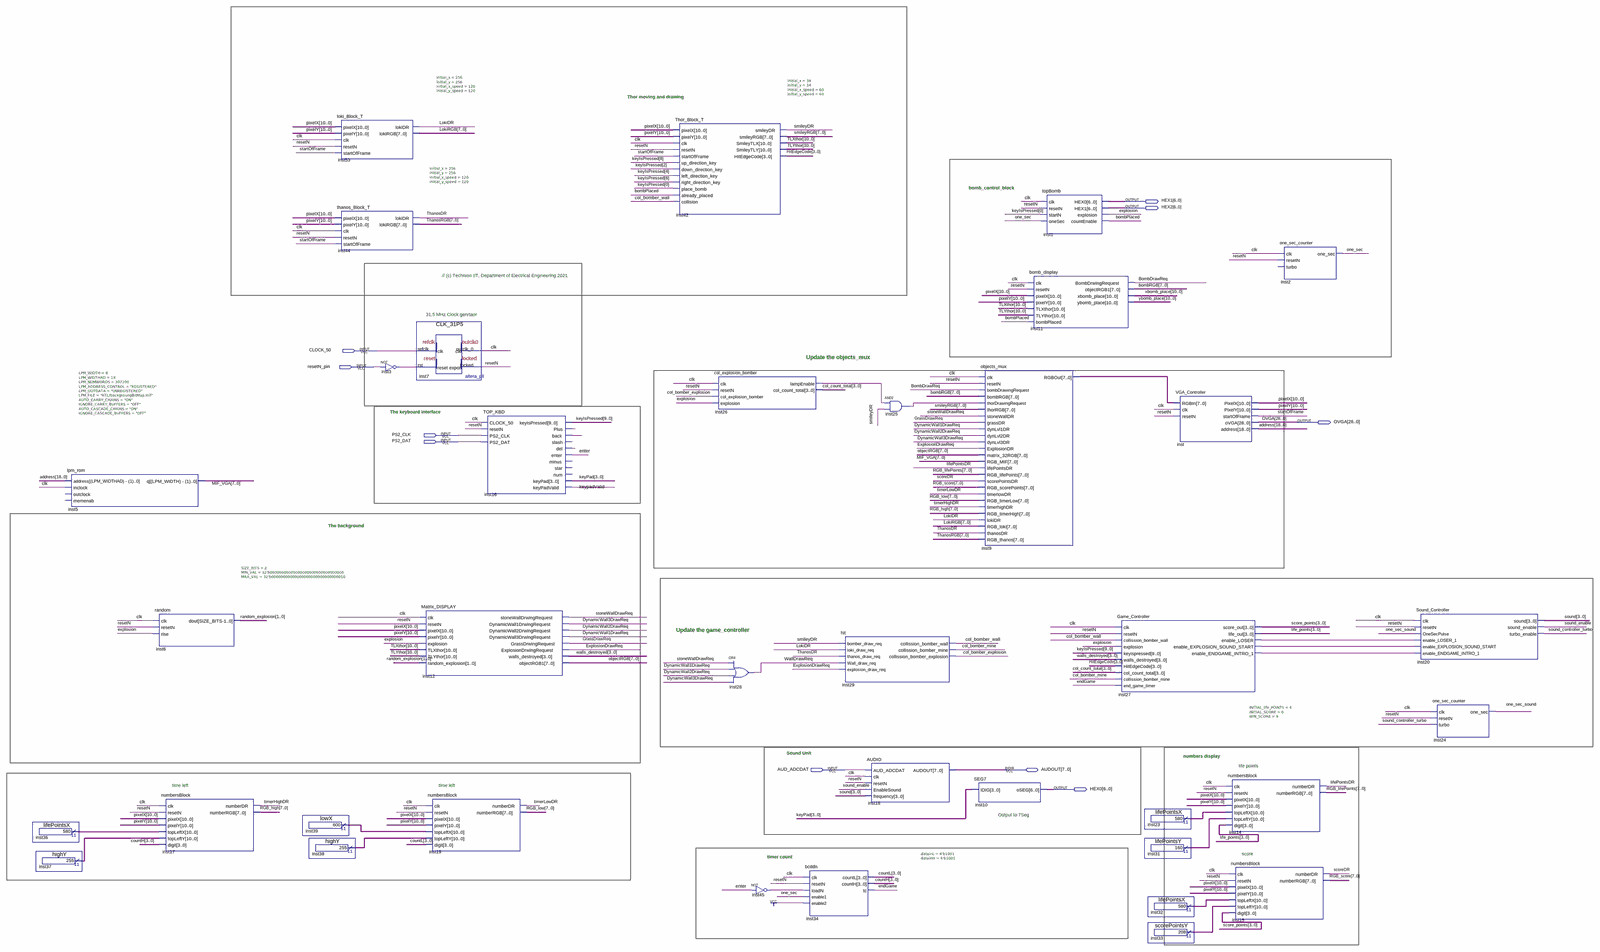
[diagram p0: schematic sheet, whole]
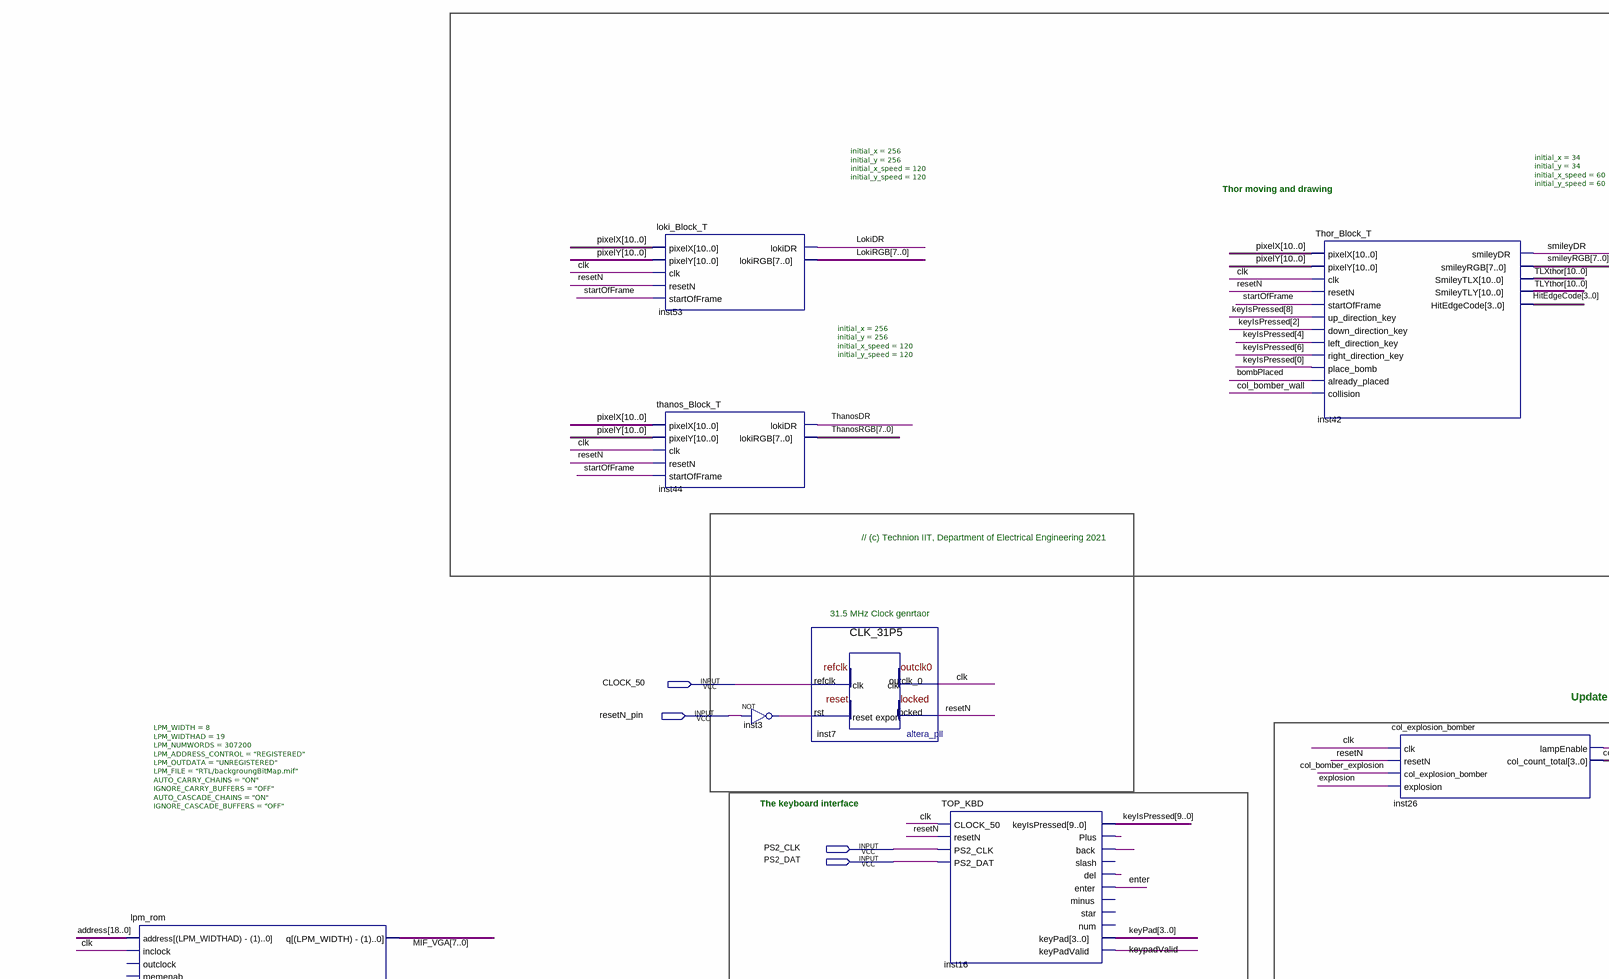
[diagram p1: schematic sheet, upper left part]
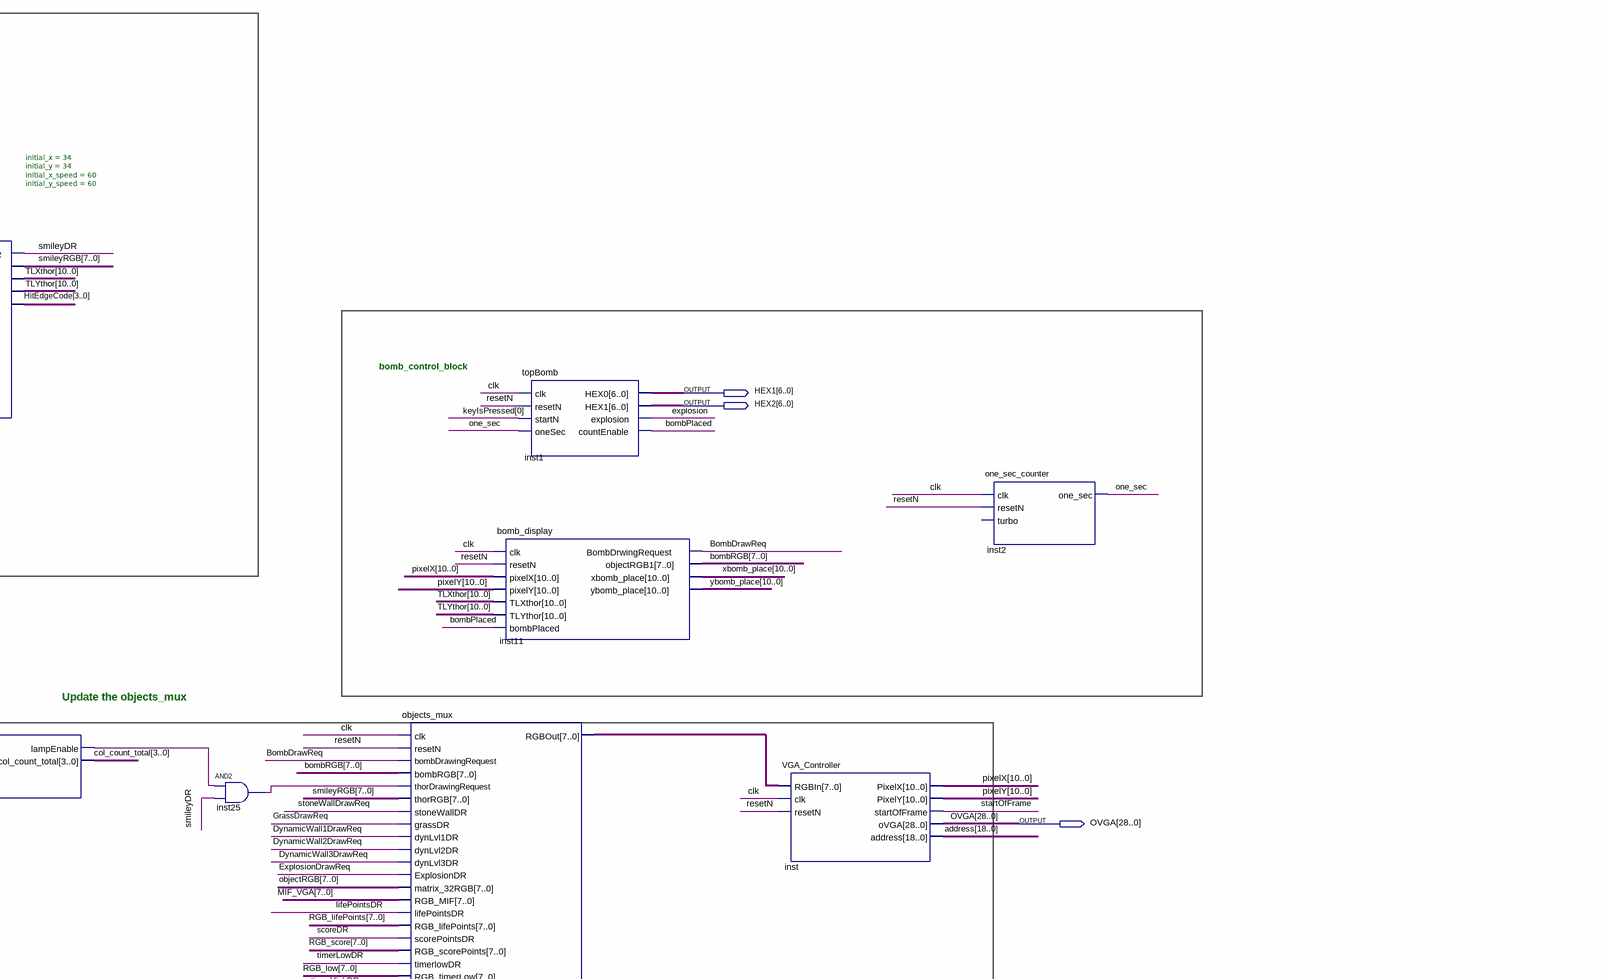
[diagram p2: schematic sheet, upper right part]
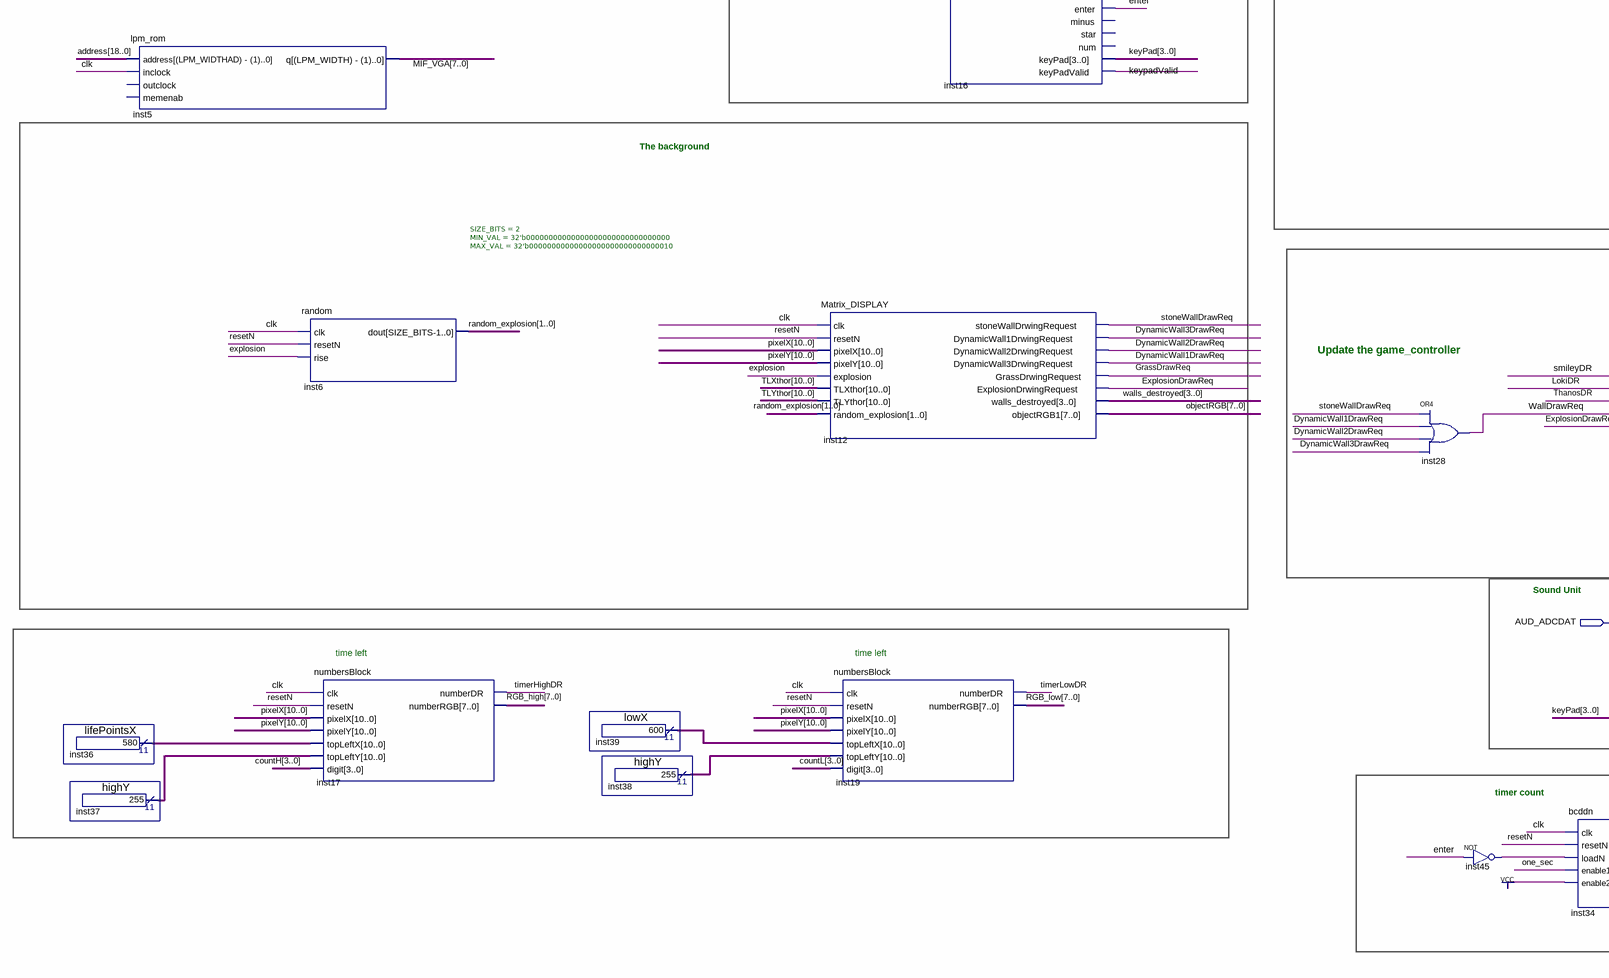
[diagram p3: schematic sheet, lower left part]
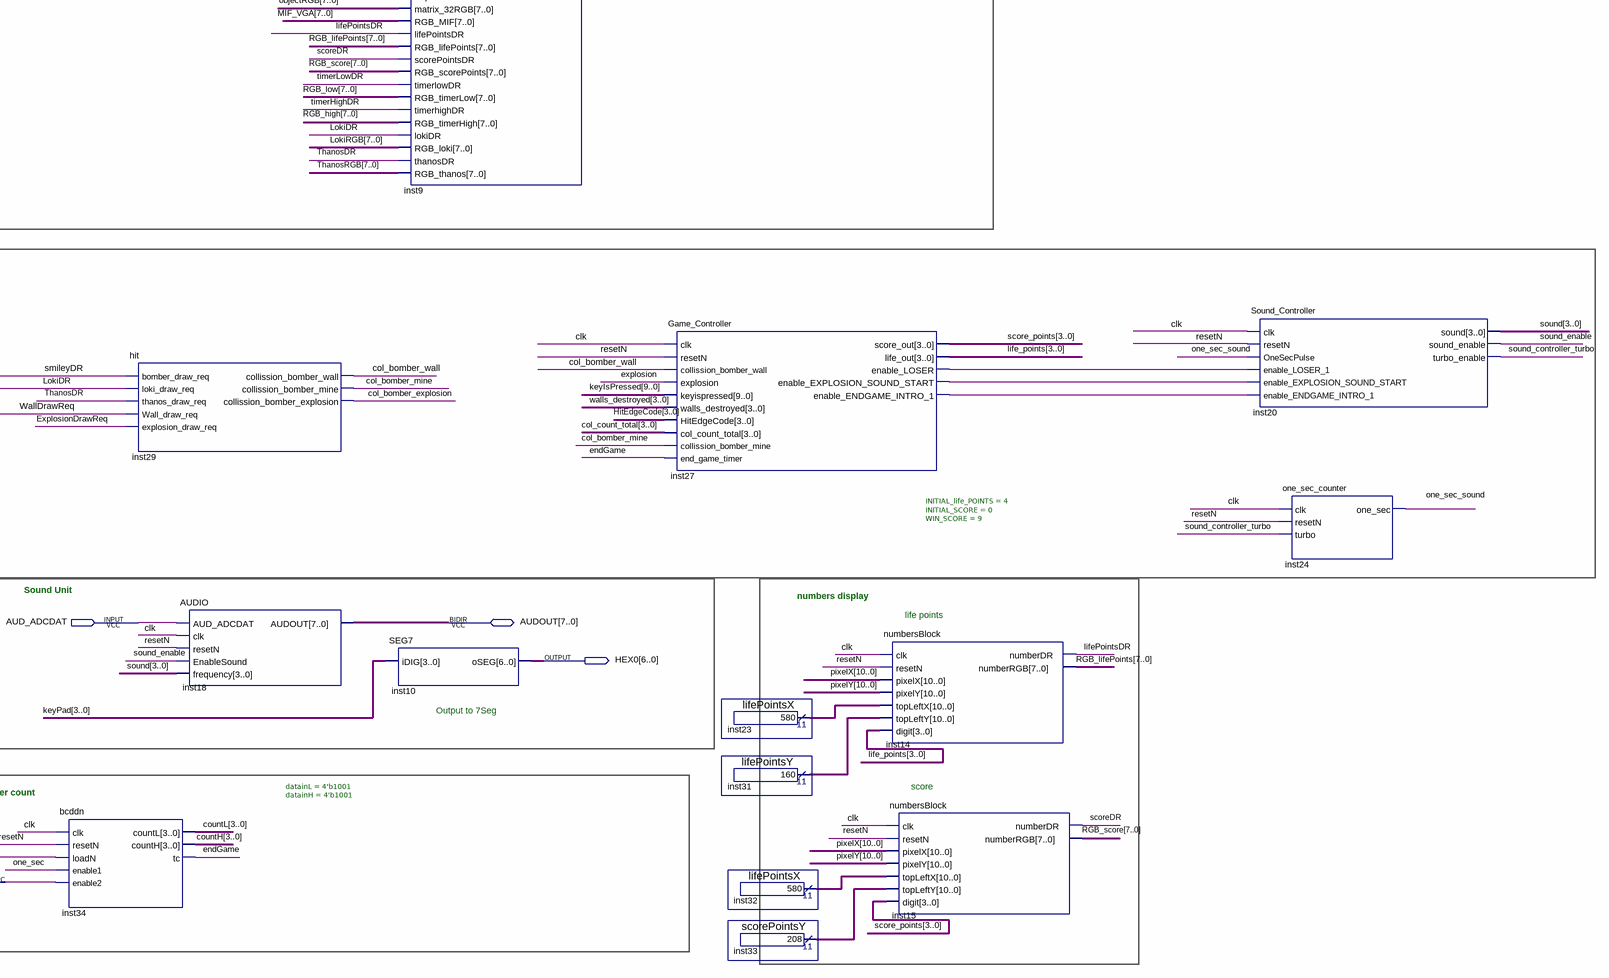
[diagram p4: schematic sheet, lower right part]
// Quartus schematic TOP_VGA_DEMO_KBD.bdf as structural Verilog: 37 symbols, 10 pins
module TOP_VGA_DEMO_KBD (
  input  CLOCK_50,
  input  resetN_pin,
  input  PS2_CLK,
  input  PS2_DAT,
  input  AUD_ADCDAT,
  inout  [7:0] AUDOUT,
  output [6:0] HEX1,
  output [6:0] HEX2,
  output [28:0] OVGA,
  output [6:0] HEX0
);

  wire BombDrawReq, bombPlaced, clk, col_bomber_explosion, col_bomber_mine, col_bomber_wall,
       DynamicWall1DrawReq, DynamicWall2DrawReq, DynamicWall3DrawReq, endGame, enter, explosion,
       ExplosionDrawReq, GrassDrawReq, inst3_out, inst16_back, inst16_del, inst16_plus, inst25_out,
       inst26_lampenable, inst27_enable_endgame_intro_1, inst27_enable_explosion_sound_start,
       inst27_enable_loser, inst45_out, keypadValid, lifePointsDR, LokiDR, one_sec, one_sec_sound, resetN,
       scoreDR, smileyDR, sound_controller_turbo, sound_enable, startOfFrame, stoneWallDrawReq, ThanosDR,
       timerHighDR, timerLowDR, WallDrawReq;
  wire [1:0] random_explosion;
  wire [3:0] col_count_total, countH, countL, HitEdgeCode, keyPad, life_points, score_points, sound,
       walls_destroyed;
  wire [7:0] bombRGB, inst9_rgbout, LokiRGB, MIF_VGA, objectRGB, RGB_high, RGB_lifePoints, RGB_low,
       RGB_score, smileyRGB, ThanosRGB;
  wire [9:0] keyIsPressed;
  wire [10:0] inst23_result, inst31_result, inst32_result, inst33_result, inst36_result, inst37_result,
       inst38_result, inst39_result, pixelX, pixelY, TLXthor, TLYthor, xbomb_place, ybomb_place;
  wire [18:0] address;

  lifePointsX inst36 (.result(inst36_result));
  highY inst37 (.result(inst37_result));
  lpm_rom #(.LPM_WIDTH(8), .LPM_WIDTHAD(19), .LPM_NUMWORDS(307200), .LPM_ADDRESS_CONTROL("REGISTERED"), .LPM_OUTDATA("UNREGISTERED"), .LPM_FILE("RTL/backgroungBitMap.mif"), .AUTO_CARRY_CHAINS("ON"), .IGNORE_CARRY_BUFFERS("OFF"), .AUTO_CASCADE_CHAINS("ON"), .IGNORE_CASCADE_BUFFERS("OFF")) inst5 (
    .address(address), .inclock(clk), .q(MIF_VGA));  // open: outclock, memenab
  random #(.SIZE_BITS(2), .MIN_VAL(32'b00000000000000000000000000000000), .MAX_VAL(32'b00000000000000000000000000000010)) inst6 (
    .clk(clk), .resetN(resetN), .rise(explosion), .dout(random_explosion));
  numbersBlock inst17 (
    .clk(clk), .resetN(resetN), .pixelX(pixelX), .pixelY(pixelY), .topLeftX(inst36_result),
    .topLeftY(inst37_result), .digit(countH), .numberDR(timerHighDR), .numberRGB(RGB_high));
  lowX inst39 (.result(inst39_result));
  highY inst38 (.result(inst38_result));
  loki_Block_T #(.initial_x(256), .initial_y(256), .initial_x_speed(120), .initial_y_speed(120)) inst53 (
    .pixelX(pixelX), .pixelY(pixelY), .clk(clk), .resetN(resetN), .startOfFrame(startOfFrame),
    .lokiDR(LokiDR), .lokiRGB(LokiRGB));
  thanos_Block_T #(.initial_x(256), .initial_y(256), .initial_x_speed(120), .initial_y_speed(120)) inst44 (
    .pixelX(pixelX), .pixelY(pixelY), .clk(clk), .resetN(resetN), .startOfFrame(startOfFrame),
    .lokiDR(ThanosDR), .lokiRGB(ThanosRGB));
  not inst3 (inst3_out, resetN_pin);
  CLK_31P5 inst7 (.refclk(CLOCK_50), .rst(inst3_out), .outclk_0(clk), .locked(resetN));
  Matrix_DISPLAY inst12 (
    .clk(clk), .resetN(resetN), .pixelX(pixelX), .pixelY(pixelY), .explosion(explosion), .TLXthor(TLXthor),
    .TLYthor(TLYthor), .random_explosion(random_explosion), .stoneWallDrwingRequest(stoneWallDrawReq),
    .DynamicWall1DrwingRequest(DynamicWall3DrawReq), .DynamicWall2DrwingRequest(DynamicWall2DrawReq),
    .DynamicWall3DrwingRequest(DynamicWall1DrawReq), .GrassDrwingRequest(GrassDrawReq),
    .ExplosionDrwingRequest(ExplosionDrawReq), .walls_destroyed(walls_destroyed), .objectRGB1(objectRGB));
  numbersBlock inst19 (
    .clk(clk), .resetN(resetN), .pixelX(pixelX), .pixelY(pixelY), .topLeftX(inst39_result),
    .topLeftY(inst38_result), .digit(countL), .numberDR(timerLowDR), .numberRGB(RGB_low));
  TOP_KBD inst16 (
    .CLOCK_50(clk), .resetN(resetN), .PS2_CLK(PS2_CLK), .PS2_DAT(PS2_DAT), .keyIsPressed(keyIsPressed),
    .Plus(inst16_plus), .back(inst16_back), .del(inst16_del), .enter(enter), .keyPad(keyPad),
    .keyPadValid(keypadValid));  // open: slash, minus, star, num
  Thor_Block_T #(.initial_x(34), .initial_y(34), .initial_x_speed(60), .initial_y_speed(60)) inst42 (
    .pixelX(pixelX), .pixelY(pixelY), .clk(clk), .resetN(resetN), .startOfFrame(startOfFrame),
    .up_direction_key(keyIsPressed[8]), .down_direction_key(keyIsPressed[2]),
    .left_direction_key(keyIsPressed[4]), .right_direction_key(keyIsPressed[6]),
    .place_bomb(keyIsPressed[0]), .already_placed(bombPlaced), .collision(col_bomber_wall),
    .smileyDR(smileyDR), .smileyRGB(smileyRGB), .SmileyTLX(TLXthor), .SmileyTLY(TLYthor),
    .HitEdgeCode(HitEdgeCode));
  col_explosion_bomber inst26 (
    .clk(clk), .resetN(resetN), .col_explosion_bomber(col_bomber_explosion), .explosion(explosion),
    .lampEnable(inst26_lampenable), .col_count_total(col_count_total));
  or inst28 (WallDrawReq, stoneWallDrawReq, DynamicWall1DrawReq, DynamicWall2DrawReq, DynamicWall3DrawReq);
  not inst45 (inst45_out, enter);
  bcddn #(.datainL(4'b1001), .datainH(4'b1001)) inst34 (
    .clk(clk), .resetN(resetN), .loadN(inst45_out), .enable1(one_sec), .enable2(1'b1), .countL(countL),
    .countH(countH), .tc(endGame));
  hit inst29 (
    .bomber_draw_req(smileyDR), .loki_draw_req(LokiDR), .thanos_draw_req(ThanosDR),
    .Wall_draw_req(WallDrawReq), .explosion_draw_req(ExplosionDrawReq),
    .collission_bomber_wall(col_bomber_wall), .collission_bomber_mine(col_bomber_mine),
    .collission_bomber_explosion(col_bomber_explosion));
  AUDIO inst18 (
    .AUD_ADCDAT(AUD_ADCDAT), .clk(clk), .resetN(resetN), .EnableSound(sound_enable), .frequency(sound),
    .AUDOUT(AUDOUT));
  and inst25 (inst25_out, inst26_lampenable, smileyDR);
  objects_mux inst9 (
    .clk(clk), .resetN(resetN), .bombDrawingRequest(BombDrawReq), .bombRGB(bombRGB),
    .thorDrawingRequest(inst25_out), .thorRGB(smileyRGB), .stoneWallDR(stoneWallDrawReq),
    .grassDR(GrassDrawReq), .dynLvl1DR(DynamicWall1DrawReq), .dynLvl2DR(DynamicWall2DrawReq),
    .dynLvl3DR(DynamicWall3DrawReq), .ExplosionDR(ExplosionDrawReq), .matrix_32RGB(objectRGB),
    .RGB_MIF(MIF_VGA), .lifePointsDR(lifePointsDR), .RGB_lifePoints(RGB_lifePoints), .scorePointsDR(scoreDR),
    .RGB_scorePoints(RGB_score), .timerlowDR(timerLowDR), .RGB_timerLow(RGB_low), .timerhighDR(timerHighDR),
    .RGB_timerHigh(RGB_high), .lokiDR(LokiDR), .RGB_loki(LokiRGB), .thanosDR(ThanosDR),
    .RGB_thanos(ThanosRGB), .RGBOut(inst9_rgbout));
  SEG7 inst10 (.iDIG(keyPad), .oSEG(HEX0));
  bomb_display inst11 (
    .clk(clk), .resetN(resetN), .pixelX(pixelX), .pixelY(pixelY), .TLXthor(TLXthor), .TLYthor(TLYthor),
    .bombPlaced(bombPlaced), .BombDrwingRequest(BombDrawReq), .objectRGB1(bombRGB),
    .xbomb_place(xbomb_place), .ybomb_place(ybomb_place));
  topBomb inst1 (
    .clk(clk), .resetN(resetN), .startN(keyIsPressed[0]), .oneSec(one_sec), .HEX0(HEX1), .HEX1(HEX2),
    .explosion(explosion), .countEnable(bombPlaced));
  Game_Controller #(.INITIAL_life_POINTS(4), .INITIAL_SCORE(0), .WIN_SCORE(9)) inst27 (
    .clk(clk), .resetN(resetN), .collission_bomber_wall(col_bomber_wall), .explosion(explosion),
    .keyispressed(keyIsPressed), .walls_destroyed(walls_destroyed), .HitEdgeCode(HitEdgeCode),
    .col_count_total(col_count_total), .collission_bomber_mine(col_bomber_mine), .end_game_timer(endGame),
    .score_out(score_points), .life_out(life_points), .enable_LOSER(inst27_enable_loser),
    .enable_EXPLOSION_SOUND_START(inst27_enable_explosion_sound_start),
    .enable_ENDGAME_INTRO_1(inst27_enable_endgame_intro_1));
  lifePointsX inst23 (.result(inst23_result));
  lifePointsY inst31 (.result(inst31_result));
  lifePointsX inst32 (.result(inst32_result));
  scorePointsY inst33 (.result(inst33_result));
  VGA_Controller inst (
    .RGBIn(inst9_rgbout), .clk(clk), .resetN(resetN), .PixelX(pixelX), .PixelY(pixelY),
    .startOfFrame(startOfFrame), .oVGA(OVGA), .address(address));
  numbersBlock inst14 (
    .clk(clk), .resetN(resetN), .pixelX(pixelX), .pixelY(pixelY), .topLeftX(inst23_result),
    .topLeftY(inst31_result), .digit(life_points), .numberDR(lifePointsDR), .numberRGB(RGB_lifePoints));
  numbersBlock inst15 (
    .clk(clk), .resetN(resetN), .pixelX(pixelX), .pixelY(pixelY), .topLeftX(inst32_result),
    .topLeftY(inst33_result), .digit(score_points), .numberDR(scoreDR), .numberRGB(RGB_score));
  one_sec_counter inst2 (.clk(clk), .resetN(resetN), .one_sec(one_sec));  // open: turbo
  Sound_Controller inst20 (
    .clk(clk), .resetN(resetN), .OneSecPulse(one_sec_sound), .enable_LOSER_1(inst27_enable_loser),
    .enable_EXPLOSION_SOUND_START(inst27_enable_explosion_sound_start),
    .enable_ENDGAME_INTRO_1(inst27_enable_endgame_intro_1), .sound(sound), .sound_enable(sound_enable),
    .turbo_enable(sound_controller_turbo));
  one_sec_counter inst24 (.clk(clk), .resetN(resetN), .turbo(sound_controller_turbo), .one_sec(one_sec_sound));

  // Notes on the sheet:
  //   Thor moving and drawing
  //   bomb_control_block
  //   // (c) Technion IIT, Department of Electrical Engineering 2021
  //   31.5 MHz Clock genrtaor
  //   Update the objects_mux
  //   The keyboard interface
  //   The background
  //   Update the game_controller
  //   Sound Unit
  //   numbers display
  //   life points
  //   time left
  //   time left
  //   Output to 7Seg
  //   score
  //   timer count
endmodule
